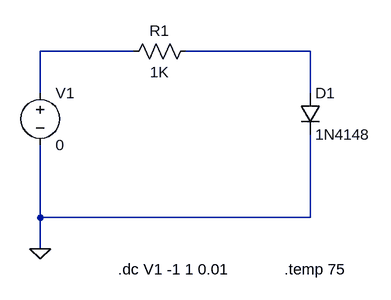
[diagram p0: schematic Temperature Effects on Diode Behavior.asc]
Temperature Effects on Diode Behavior.asc, the LTspice schematic file:
Version 4.1
SHEET 1 880 680
WIRE 208 64 64 64
WIRE 480 64 288 64
WIRE 64 128 64 64
WIRE 480 128 480 64
WIRE 64 320 64 208
WIRE 480 320 480 192
WIRE 480 320 64 320
WIRE 64 368 64 320
FLAG 64 368 0
SYMBOL voltage 64 112 R0
SYMATTR InstName V1
SYMATTR Value 0
SYMBOL res 304 48 R90
WINDOW 0 0 56 VBottom 2
WINDOW 3 32 56 VTop 2
SYMATTR InstName R1
SYMATTR Value 1K
SYMBOL diode 464 128 R0
SYMATTR InstName D1
SYMATTR Value 1N4148
TEXT 184 400 Left 2 !.dc V1 -1 1 0.01
TEXT 440 400 Left 2 !.temp 75

The netlist it stands for:
* Temperature Effects on Diode Behavior.asc
V1 N001 0 0
R1 N002 N001 1K
D1 N002 0 1N4148
.model D D
.lib standard.dio
.dc V1 -1 1 0.01
.temp 75
.backanno
.end